# EAGLE design BA2PogoBed (EAGLE 9.0.0)

## Sheet 1 of 2
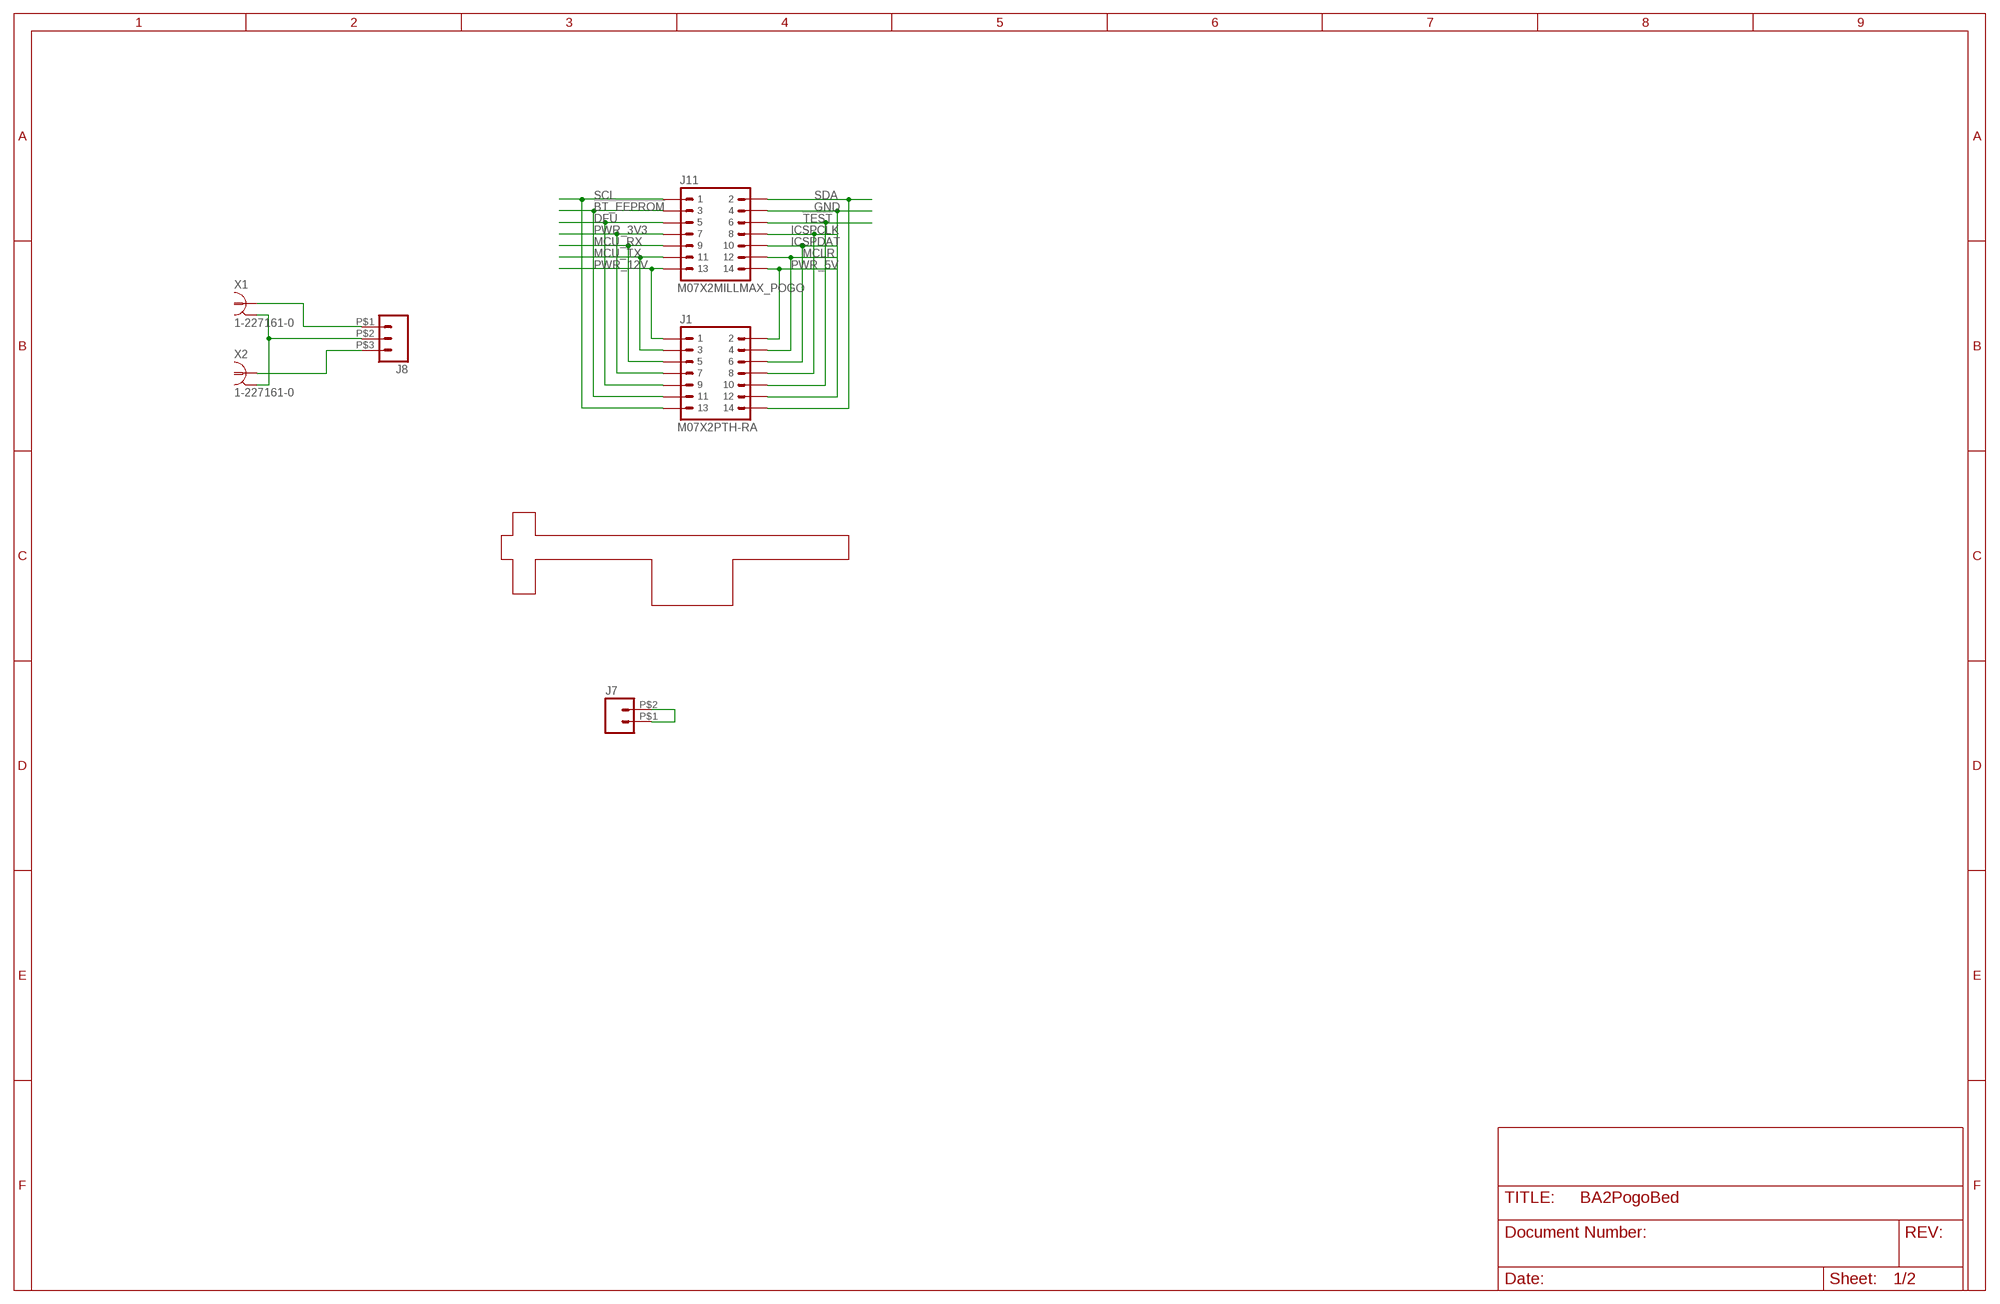
[diagram p0: schematic, sheet 1]

### Parts
J1  M07X2PTH-RA  [JST-14-PUD-PTH]
J7  M02  [MILLMAX_838_1X2]
J8  M03  [MILLMAX_836_1X3]
J11  M07X2MILLMAX_POGO  [MILLMAX_838_7X2]
M1  TOGGLE_CLAMP_LARGE  [TOGGLE_CLAMP_LARGE]
X1  1-227161-0  [AMP_227161]
X2  1-227161-0  [AMP_227161]

### Nets
!BT_EEPROM: J1.P$11 J11.P$3
!TEST: J1.P$10 J11.P$6
DFU: J1.P$9 J11.P$5
GND: J1.P$12 J11.P$4
ICSPCLK: J1.P$8 J11.P$8
ICSPDAT: J1.P$6 J11.P$10
MCLR: J1.P$4 J11.P$12
MCU_RX: J1.P$5 J11.P$9
MCU_TX: J1.P$3 J11.P$11
N$1: J7.P$1 J7.P$2
N$2: J8.P$2 X1.2 X2.2
N$3: J8.P$1 X1.1
N$4: J8.P$3 X2.1
PWR_3V3: J1.P$7 J11.P$7
PWR_5V: J1.P$2 J11.P$14
PWR_12V: J1.P$1 J11.P$13
SCL: J1.P$13 J11.P$1
SDA: J1.P$14 J11.P$2

## Sheet 2 of 2

## Library data of the parts
J1 = spareparts:M07X2: 14 pin 2 row 2mm pitch JST PUD series connector; DIGI_PN: 455-2488-ND; MFN: JST Sales America Inc.; MFP: S14B-PUDSS-1(LF)(SN)
J7 = spareparts:M02: Standard 2-pin 0.1" header. Use with - straight break away headers ( PRT-00116) - right angle break away headers (PRT-00553) - swiss pins (PRT-00743) - machine pins (PRT-00117) - female headers (PRT-00115) Molex polarized connector foot print use with: PRT-08233 with associated crimp pins and housings. 2.54_SCREWTERM for use with PRT-10571. 3.5mm Screw Terminal footprints for PRT-08084 5mm Screw Terminal footprints for use with PRT-08432
J8 = spareparts:M03: Header 3 Standard 3-pin 0.1" header. Use with straight break away headers (SKU : PRT-00116), right angle break away headers (PRT-00553), swiss pins (PRT-00743), machine pins (PRT-00117), and female headers (PRT-00115). Molex polarized connector foot print use with SKU : PRT-08232 with associated crimp pins and housings.
J11 = spareparts:M07X2: 14 pin 2 row 2mm pitch JST PUD series connector
M1 = spareparts:TOGGLE_CLAMP_LARGE: HH-201B toggle clamp
X1 X2 = con-coax:?227161*: JACK, RIGHT ANGLE, 50 OHM, PCB, BNC Source: amp_227161.pdf; MF: TYCO ELECTRONICS; MPN: 1-227161; OC_FARNELL: unknown; OC_NEWARK: 33B3200

## Board
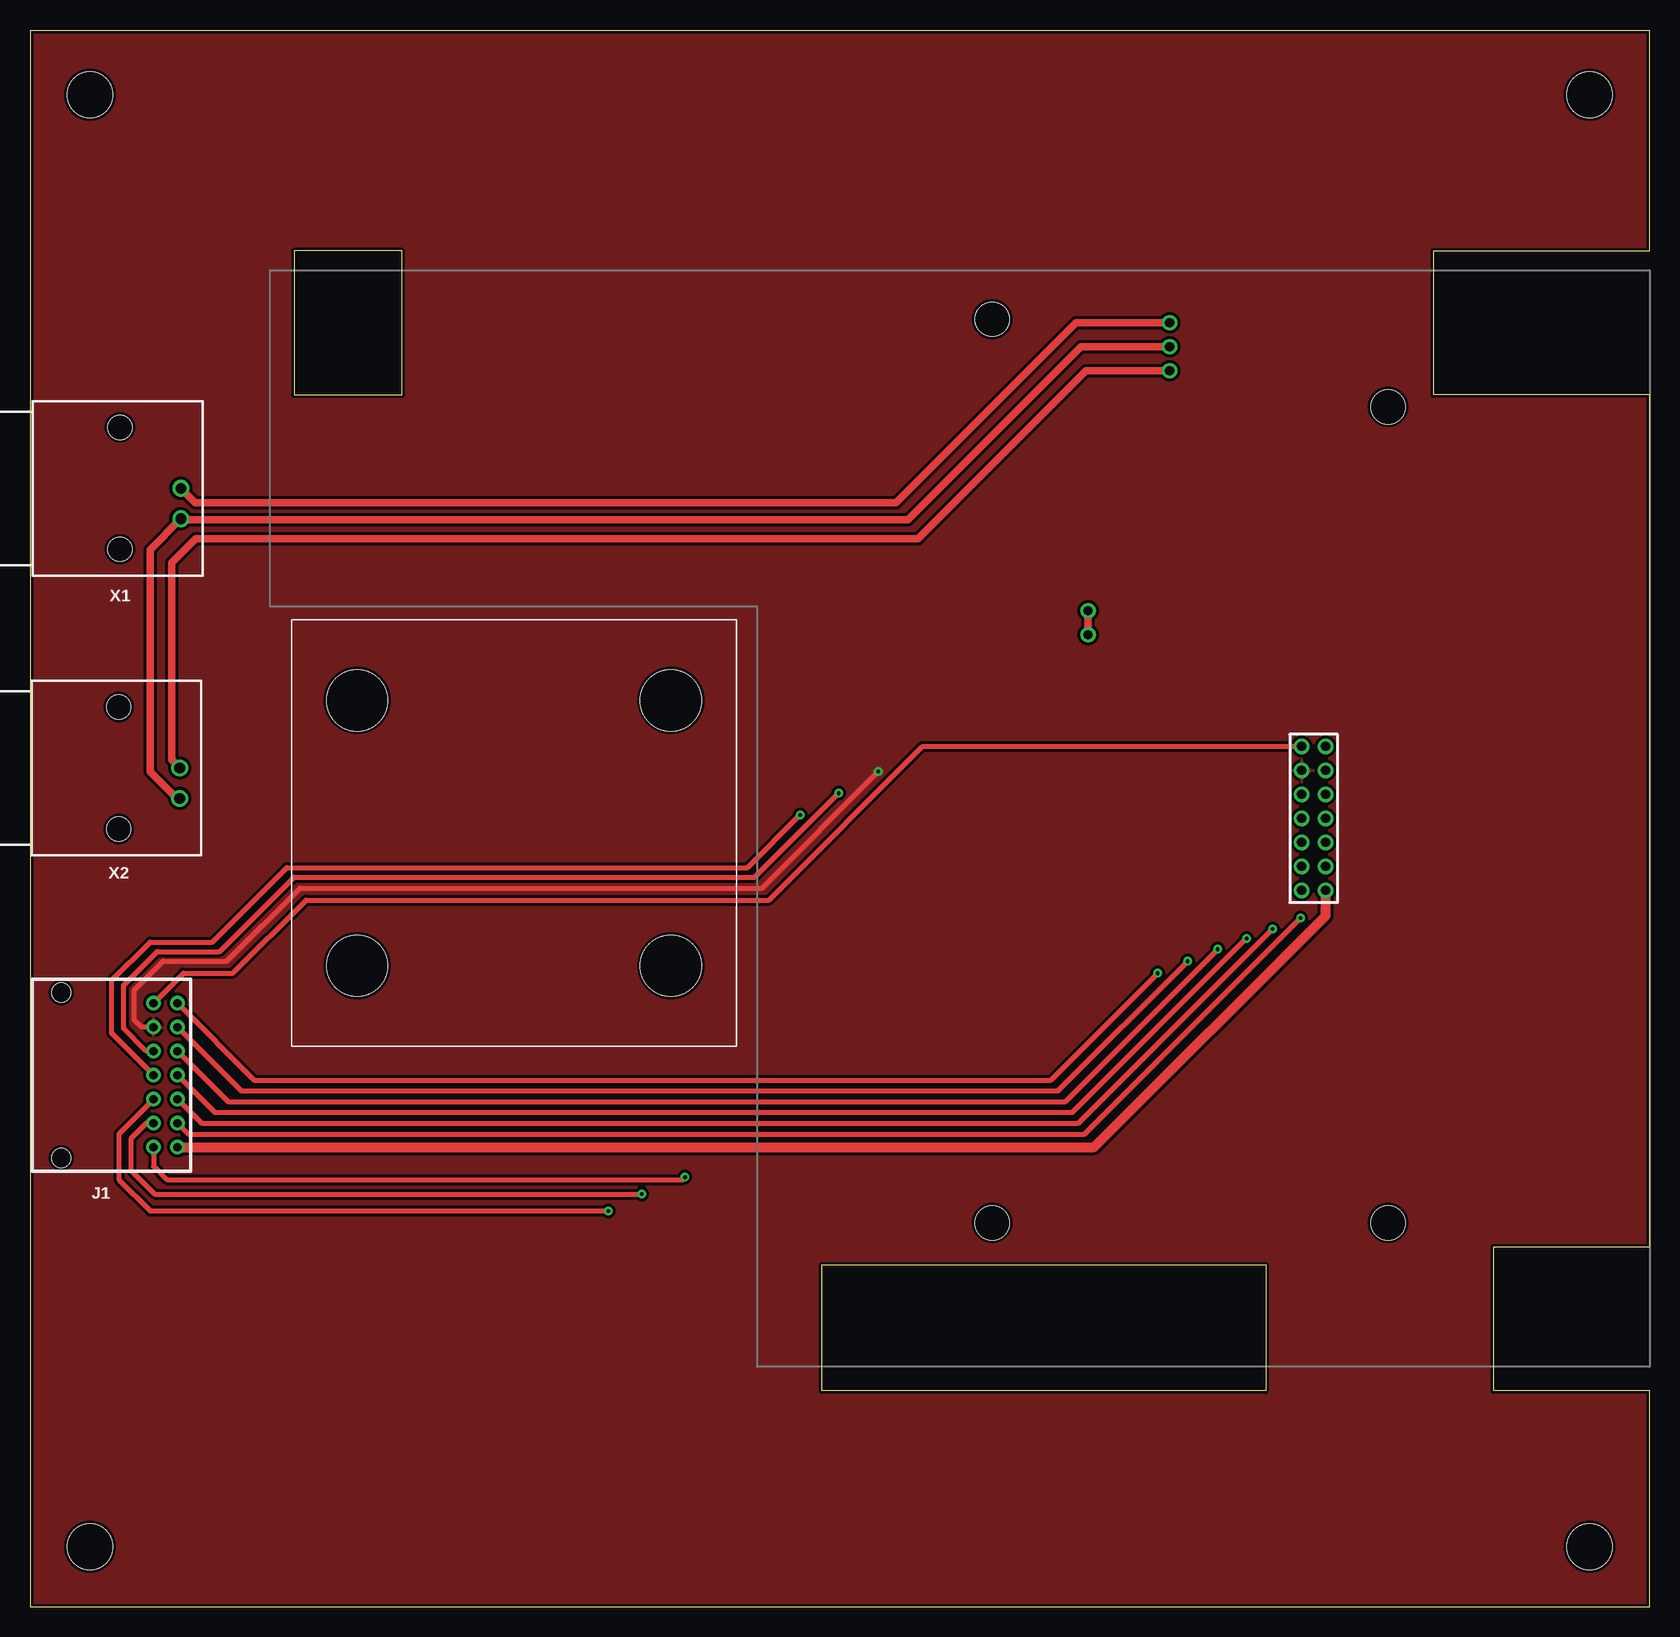
[diagram p1: board, top side]
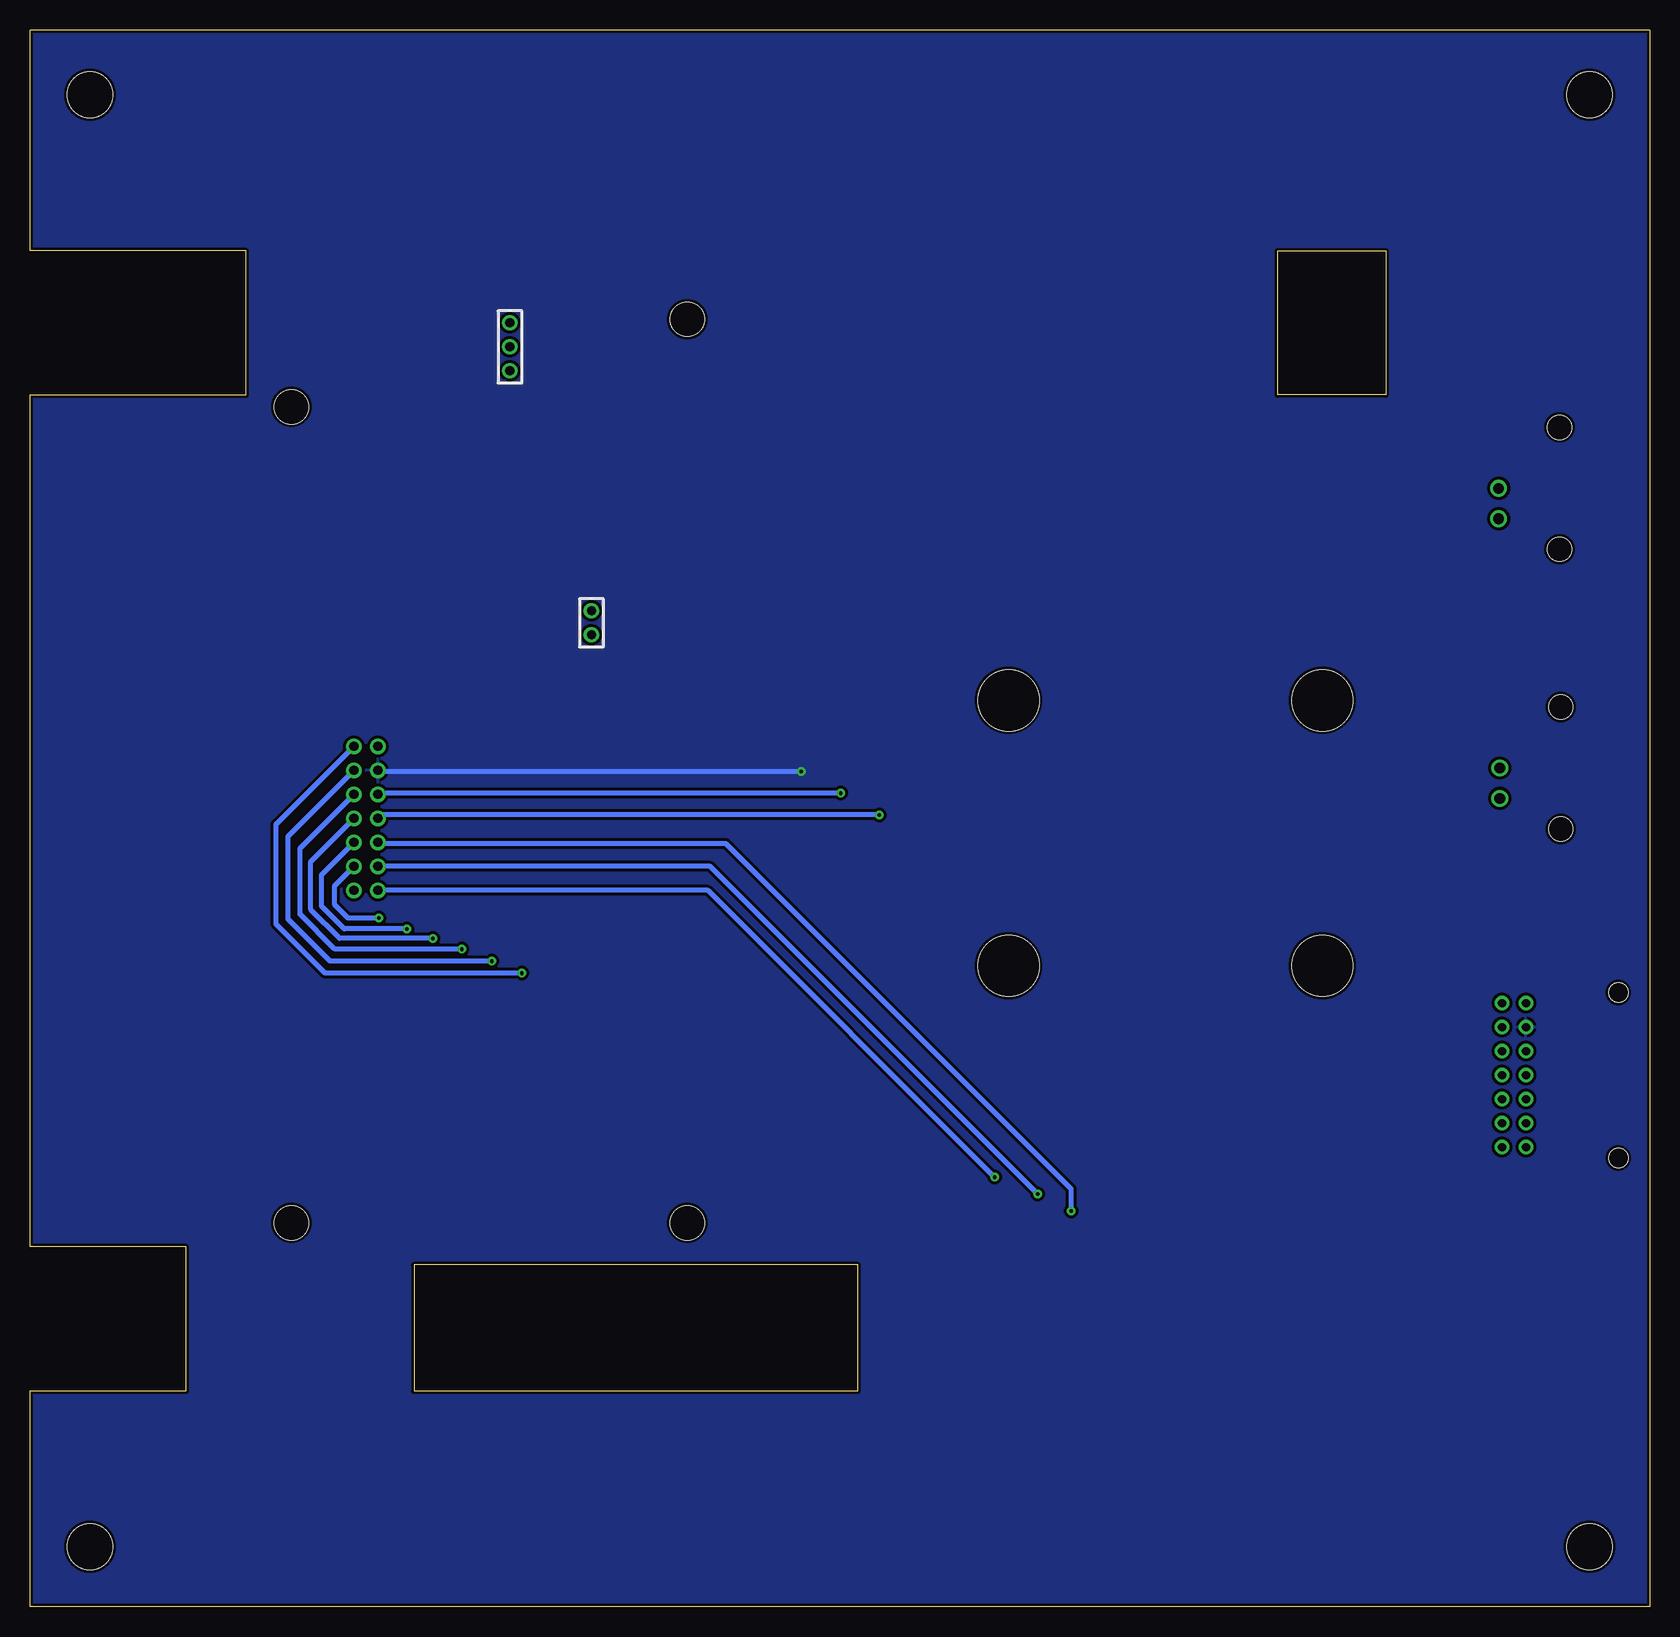
[diagram p2: board, bottom side, seen from below]

Size 135 x 131.4 mm. Coordinates in mm from the lower left corner, seen from the top.
Outline: 0,131.4 135,131.4 135,113 117,113 117,101 135,101 135,30 122,30 122,18 135,18 135,0 0,0 0,131.4
Outline: 22,101 31,101 31,113 22,113 22,101
Outline: 66,28.5 103,28.5 103,18 66,18 66,28.5
Copper layers (1*16): Top 0.035mm / dielectric 1.5mm / Bottom 0.035mm
Design rules "default *": minimum track width 6mil, minimum drill 0.3mm, track to track 6mil, track to pad 6mil, pad to pad 6mil, via to via 6mil, smd to smd 5mil, copper to edge 10mil, drill to drill 8mil, minimum pad ring 10mil, minimum via ring 8mil, stop-mask expansion 4mil, vias tented up to drill 17mil, thermal gap 10mil
Holes 2.85 mm at 80.2,32 113.2,32 80.2,107.3 113.2,100
Holes 3.8 mm at 5,5 130,5 130,126 5,126

### Footprints (pad centres in the part's own frame; a part is rotated, then mirrored left to right if it is on the bottom)
JST-14-PUD-PTH = drill 0.7: P$1 0,1; P$2 0,3; P$3 2,1; P$4 2,3; P$5 4,1; P$6 4,3; P$7 6,1; P$8 6,3; P$9 8,1; P$10 8,3; P$11 10,1; P$12 10,3; P$13 12,1; P$14 12,3 | hole 1.6: -0.9,10.7; 12.9,10.7
MILLMAX_838_1X2 = drill 0.762: P$1 0,0; P$2 2,0
MILLMAX_836_1X3 = drill 0.762: P$1 0,0; P$2 2,0; P$3 4,0
MILLMAX_838_7X2 = drill 0.762: P$1 12,0; P$2 12,2; P$3 10,0; P$4 10,2; P$5 8,0; P$6 8,2; P$7 6,0; P$8 6,2; P$9 4,0; P$10 4,2; P$11 2,0; P$12 2,2; P$13 0,0; P$14 0,2
TOGGLE_CLAMP_LARGE = hole 5.08: 5.461,6.731; 31.623,6.731; 5.461,28.829; 31.623,28.829
AMP_227161 = drill 0.9 pad 1.27: 1 0,-5.08; 2 -2.54,-5.08 | hole 2: -5.08,0; 5.08,0

### Placement (x,y rotation side)
J1  13.3,38.3 90 top
J7  88.2,83 270 bottom
J8  95,107 270 bottom
J11  108,59.7 90 top
M1  21.8,46.7 0 top
X1  7.5,93.2 90 top
X2  7.4,69.9 90 top

### Tracks (layer width: path | path; a pad name or v marks a point on that pad's centre or on a via)
!BT_EEPROM  (via drill 0.3)
  Top 0.406: J1.P$11 17.6,43 85.7,43 v96.5,53.8
  Bottom 0.406: v96.5,53.8 110,53.8 113.5,57.3 113.5,64.2 J11.P$3
!TEST  (via drill 0.3)
  Top 0.406: J1.P$10 9.7,46.3 7.8,48.2 7.8,51.8 10.6,54.6 15.8,54.6 22,60.8 60.4,60.8 v67.4,67.8
  Bottom 0.406: v67.4,67.8 105.9,67.8 J11.P$6
DFU  (via drill 0.3)
  Top 0.406: J1.P$9 16.5,42.1 86.3,42.1 v99,54.8
  Bottom 0.406: v99,54.8 109.6,54.8 112.5,57.7 112.5,63.2 J11.P$5
GND  (via drill 0.3)
  Top 0.406: J1.P$12 9.3,48.3 8.7,48.9 8.7,51.4 11.1,53.8 16.4,53.8 22.5,59.9 61,59.9 v70.7,69.6
  Bottom 0.406: v70.7,69.6 105.9,69.6 J11.P$4
  pour Bottom (isolate 0.254, rank 3): 0,131.4 135,131.4 135,0 0,0
  pour Top (isolate 0.254, rank 3): 0,0 135,0 135,131.4 0,131.4
ICSPCLK  (via drill 0.3)
  Top 0.406: J1.P$8 6.8,47.8 6.8,52.2 10,55.4 15.2,55.4 21.4,61.6 59.8,61.6 v64.2,66
  Bottom 0.406: v64.2,66 105.7,66 J11.P$8
ICSPDAT  (via drill 0.3)
  Top 0.406: J1.P$6 7.4,39.4 7.4,35.6 10,33 v48.2,33
  Bottom 0.406: v48.2,33 48.2,34.8 77,63.6 105.9,63.6 J11.P$10
MCLR  (via drill 0.3)
  Top 0.406: J1.P$4 9.7,40.3 8.4,39 8.4,36.4 10.4,34.4 v51,34.4
  Bottom 0.406: v51,34.4 78.3,61.7 J11.P$12
MCU_RX  (via drill 0.3)
  Top 0.406: J1.P$5 14.3,40.3 87.4,40.3 v103.6,56.5
  Bottom 0.406: v103.6,56.5 108.8,56.5 110.7,58.4 110.7,61 J11.P$9
MCU_TX  (via drill 0.3)
  Top 0.406: J1.P$3 13.2,39.4 87.9,39.4 v105.9,57.4
  Bottom 0.406: v105.9,57.4 108.5,57.4 109.6,58.5 109.6,60.1 J11.P$11
N$1
  Top 0.61: J7.P$2 J7.P$1
N$2
  Top 0.61: J8.P$2 87.6,105 73.2,90.6 12.64,90.6 X1.2 10,88.08 10,69.6 12.24,67.36 X2.2
N$3
  Top 0.61: J8.P$1 87.2,107 72.2,92 13.78,92 X1.1
N$4
  Top 0.61: J8.P$3 88,103 74,89 13.8,89 11.8,87 11.8,70.58 X2.1
PWR_3V3  (via drill 0.3)
  Top 0.406: J1.P$7 15.4,41.2 86.9,41.2 v101.4,55.7
  Bottom 0.406: v101.4,55.7 109.2,55.7 111.6,58.1 111.6,62.1 J11.P$7
PWR_5V  (via drill 0.3)
  Top 0.406: J1.P$2 10.3,36.7 11.4,35.6 54.4,35.6 v54.6,35.8
  Bottom 0.406: v54.6,35.8 78.5,59.7 J11.P$14
PWR_12V
  Top 0.813: J1.P$1 88.7,38.3 108,57.6 J11.P$13
SCL  (via drill 0.3)
  Top 0.406: J1.P$13 18.7,43.9 85.1,43.9 v94,52.8
  Bottom 0.406: v94,52.8 110.4,52.8 114.5,56.9 114.5,65.2 J11.P$1
SDA
  Top 0.406: J1.P$14 12.8,52.8 16.9,52.8 23,58.9 61.6,58.9 74.4,71.7 J11.P$2

### Text on the board
tDocu: RIGHT | LEFT | MDeck Programmer | BA-2 Production Programming / Pogo Bed